# EAGLE design DCmixer (EAGLE 9.2.0)
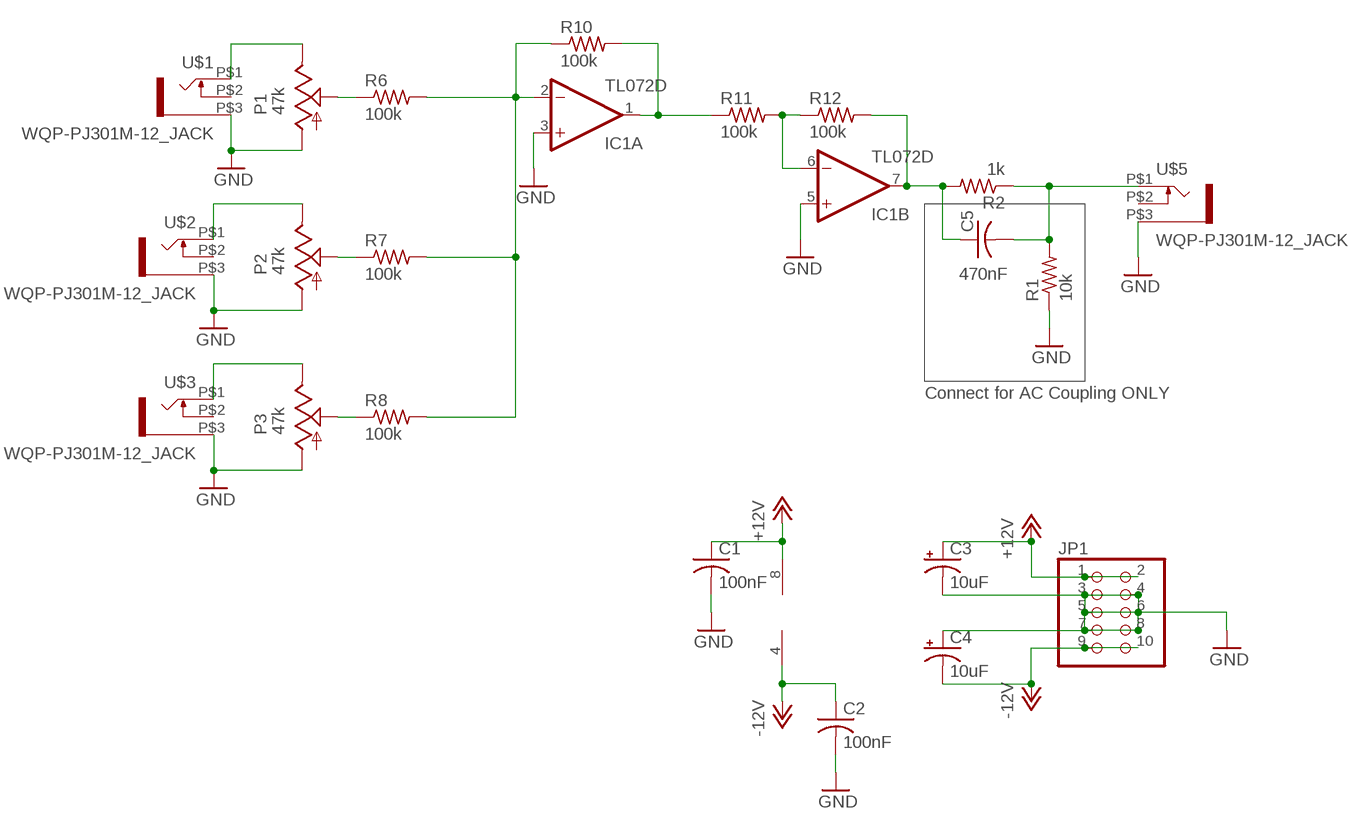
[diagram p0: schematic, sheet 1]

## Parts
C1  100nF  C-USC0603K  [C0603K]
C2  100nF  C-USC0603K  [C0603K]
C3  10uF  CPOL-USE2-5  [E2-5]
C4  10uF  CPOL-USE2-5  [E2-5]
C5  470nF  C-USC0603K  [C0603K]
IC1  TL072D  [SO08]
JP1  PINHD-2X5  [2X05]
P1  47k  US-EVUF2A  [EVUF]
P2  47k  US-EVUF2A  [EVUF]
P3  47k  US-EVUF2A  [EVUF]
R1  10k  R-US_R0603  [R0603]
R2  1k  R-US_R0603  [R0603]
R6  100k  R-US_R0603  [R0603]
R7  100k  R-US_R0603  [R0603]
R8  100k  R-US_R0603  [R0603]
R10  100k  R-US_R0603  [R0603]
R11  100k  R-US_R0603  [R0603]
R12  100k  R-US_R0603  [R0603]
U$1  WQP-PJ301M-12_JACK  [WQP-PJ301M-12_JACK]
U$2  WQP-PJ301M-12_JACK  [WQP-PJ301M-12_JACK]
U$3  WQP-PJ301M-12_JACK  [WQP-PJ301M-12_JACK]
U$5  WQP-PJ301M-12_JACK  [WQP-PJ301M-12_JACK]

## Nets
+12V: C1.1 C3.+ IC1.8(P:V+) JP1.1 JP1.2
-12V: C2.1 C4.- IC1.4(P:V-) JP1.9 JP1.10
GND: C1.2 C2.2 C3.- C4.+ IC1.3(A:+IN) IC1.5(B:+IN) JP1.3 JP1.4 JP1.5 JP1.6 JP1.7 JP1.8 P1.1(A) P2.1(A) P3.1(A) R1.1 U$1.P$3 U$2.P$3 U$3.P$3 U$5.P$3
N$1: P1.3(E) U$1.P$1
N$2: P2.3(E) U$2.P$1
N$3: P3.3(E) U$3.P$1
N$6: P3.2(S) R8.1
N$7: P2.2(S) R7.1
N$8: P1.2(S) R6.1
N$9: IC1.2(A:-IN) R6.2 R7.2 R8.2 R10.1
N$10: C5.2 R1.2 R2.1 U$5.P$1
N$11: IC1.1(A:OUT) R10.2 R11.1
N$14: IC1.6(B:-IN) R11.2 R12.1
N$15: C5.1 IC1.7(B:OUT) R2.2 R12.2
Unconnected: U$1.P$2 U$2.P$2 U$3.P$2 U$5.P$2

## Notes on the sheet
- Connect for AC Coupling ONLY

## Library data of the parts
C1 C2 C5 = rcl:C-US: CAPACITOR, American symbol; SPICEPREFIX: C
C3 C4 = rcl:CPOL-US: POLARIZED CAPACITOR, American symbol; SPICEPREFIX: C
IC1 = linear:TL072: OP AMP
JP1 = pinhead:PINHD-2X5: PIN HEADER
P1-P3 = pot:US-EVU: 9 mm Square Rotary Potentiometers Source: Panasonic
R1 R2 R6-R8 R10-R12 = rcl:R-US_: RESISTOR, American symbol; SPICEPREFIX: R
U$1-U$3 U$5 = thonkiconn:WQP-PJ301M-12_JACK

## Board
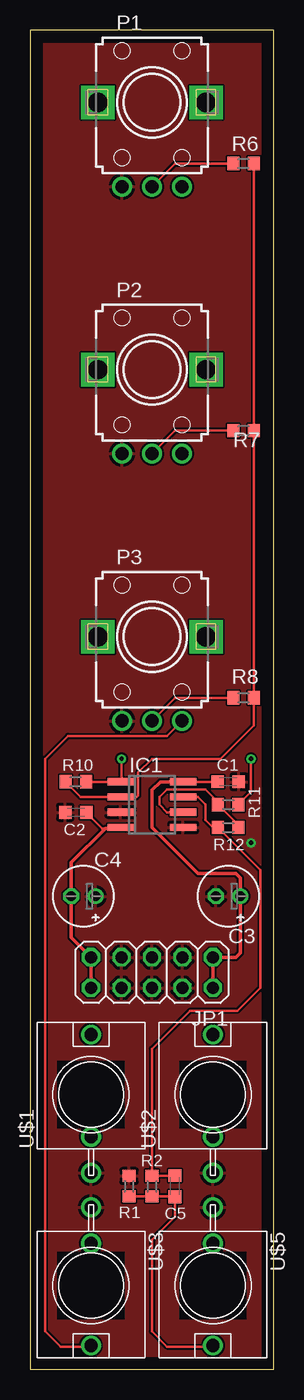
[diagram p1: board, top side]
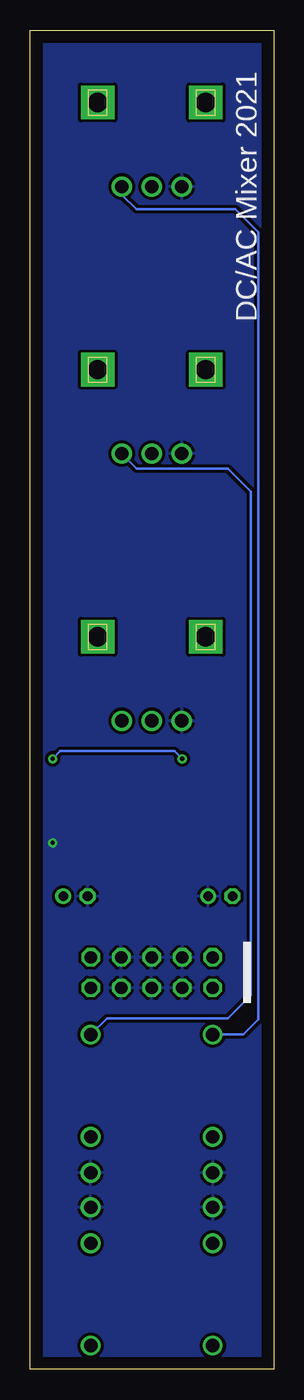
[diagram p2: board, bottom side, seen from below]

Size 20.3 x 111.43 mm. Coordinates in mm from the lower left corner, seen from the top.
Outline: 0,0 20.3,0 20.3,111.43 0,111.43 0,0
Copper layers (1*16): Top 0.035mm / dielectric 1.5mm / Bottom 0.035mm
Design rules "default": minimum track width 6mil, minimum drill 0.35mm, track to track 6mil, track to pad 6mil, pad to pad 6mil, via to via 6mil, smd to smd 6mil, copper to edge 40mil, drill to drill 6mil, minimum pad ring 10mil, minimum via ring 8mil, stop-mask expansion 4mil, vias tented up to drill 0mil, thermal gap 10mil

### Footprints (pad centres in the part's own frame; a part is rotated, then mirrored left to right if it is on the bottom)
C0603K = smd 1.05 x 1.08: 1 -0.875,0; 2 0.875,0
E2-5 = drill 0.813 pad 1.27: + -1.016,0 | drill 0.813 pad 1.27 octagon: - 1.016,0
SO08 = smd 0.6 x 2.2: 1 -1.905,-2.6; 2 -0.635,-2.6; 3 0.635,-2.6; 4 1.905,-2.6; 5 1.905,2.6; 6 0.635,2.6; 7 -0.635,2.6; 8 -1.905,2.6
2X05 = drill 1.016 octagon: 1 -5.08,-1.27; 2 -5.08,1.27; 3 -2.54,-1.27; 4 -2.54,1.27; 5 0,-1.27; 6 0,1.27; 7 2.54,-1.27; 8 2.54,1.27; 9 5.08,-1.27; 10 5.08,1.27
EVUF = drill 1.1 pad 1.676: 1 -2.5,-7; 2 0,-7; 3 2.5,-7 | drill 1.6 pad 2.8 square: M1 4.5,0; M2 -4.5,0
R0603 = smd 1 x 1.1: 1 -0.85,0; 2 0.85,0
WQP-PJ301M-12_JACK = drill 1.1: P$1 0,5; P$2 0,-3.5; P$3 0,-6.5

### Placement (x,y rotation side)
C1  16.51,48.9 0 top
C2  3.81,46.35 180 top
C3  16.51,39.37 180 top
C4  4.45,39.37 180 top
C5  12.06,15.24 270 top
IC1  10.16,46.99 270 top
JP1  10.16,33.02 180 top
P1  10.16,105.41 0 top
P2  10.16,83.19 0 top
P3  10.16,60.96 0 top
R1  8.26,15.24 270 top
R2  10.16,15.24 90 top
R6  17.78,100.33 0 top
R7  17.78,78.11 0 top
R8  17.78,55.88 0 top
R10  3.81,48.9 0 top
R11  16.51,46.99 180 top
R12  16.51,45.09 180 top
U$1  5.08,22.86 0 top
U$2  15.24,22.86 0 top
U$3  5.08,6.99 180 top
U$5  15.24,6.99 180 top

### Tracks (layer width: path | path; a pad name or v marks a point on that pad's centre or on a via)
+12V
  Top 0.203: C1.1 IC1.8
  Top 0.305: JP1.2 JP1.1 17.14,34.29 17.53,34.67 C3.+ 17.53,40.89 17.14,41.27 13.97,41.27 10.16,45.09 10.16,48.2 10.86,48.9 IC1.8
-12V
  Top 0.203: IC1.4 7.62,45.02 6.02,45.02 C2.1
  Top 0.305: JP1.10 JP1.9 3.43,35.94 C4.- 3.43,42.16 6.29,45.02 7.62,45.02
GND  (via drill 0.35)
  other vias: 18.41,43.81
  pour Top: 0.64,110.49 19.68,110.49 19.68,0.64 0.64,0.64
  pour Bottom (isolate 0.254): 0.64,110.49 19.68,110.49 19.68,0.64 0.64,0.64
N$1
  Bottom 0.203: U$1.P$1 2.54,27.86 1.27,29.13 1.27,94.61 3.17,96.52 11.43,96.52 12.66,97.75 P1.3
N$2
  Bottom 0.203: U$2.P$1 13.89,29.21 3.81,29.21 1.91,31.11 1.91,73.03 3.81,74.93 11.43,74.93 12.66,76.16 P2.3
N$3
  Top 0.203: U$3.P$1 5,1.91 2.54,1.91 1.27,3.17 1.27,50.8 3.17,52.7 11.43,52.7 12.66,53.94 P3.3
N$6
  Top 0.203: P3.2 12.08,55.88 R8.1
N$7
  Top 0.203: P2.2 12.08,78.11 R7.1
N$8
  Top 0.203: P1.2 12.08,100.33 R6.1
N$9
  Top 0.203: R6.2 R7.2 R8.2 18.63,53.55 15.88,50.8 10.16,50.8 9.02,49.66 9.02,47.75 8.89,47.62 IC1.2 | R10.1 4.23,47.62 IC1.2 | IC1.2 8.26,47.62
N$10
  Top 0.203: R1.2 R2.1 12.04,14.39 C5.2 12.06,12.7 10.16,10.79 10.16,3.17 11.43,1.91 15.16,1.91 U$5.P$1
N$11  (via drill 0.35)
  Top 0.203: R10.2 IC1.1 7.62,48.95 v7.62,50.8 | R11.1 18.41,48.05 v18.41,50.8
  Bottom 0.203: v7.62,50.8 8.26,51.44 17.78,51.44 v18.41,50.8
N$14
  Top 0.203: IC1.6 11.43,46.35 10.79,46.99 10.79,47.62 11.43,48.26 14.61,48.26 15.66,47.2 R11.2 17.36,45.29 R12.1
N$15
  Top 0.203: C5.1 12.04,16.09 R2.2 10.16,26.67 13.33,29.84 17.28,29.84 19.18,31.75 19.18,41.56 R12.2 15.77,44.98 15.35,44.98 14.61,45.72 14.61,46.99 13.97,47.62 IC1.7

### Text on the board
bNames: DC/AC Mixer 2021